# EAGLE design motor_driver (EAGLE 6.6.0)
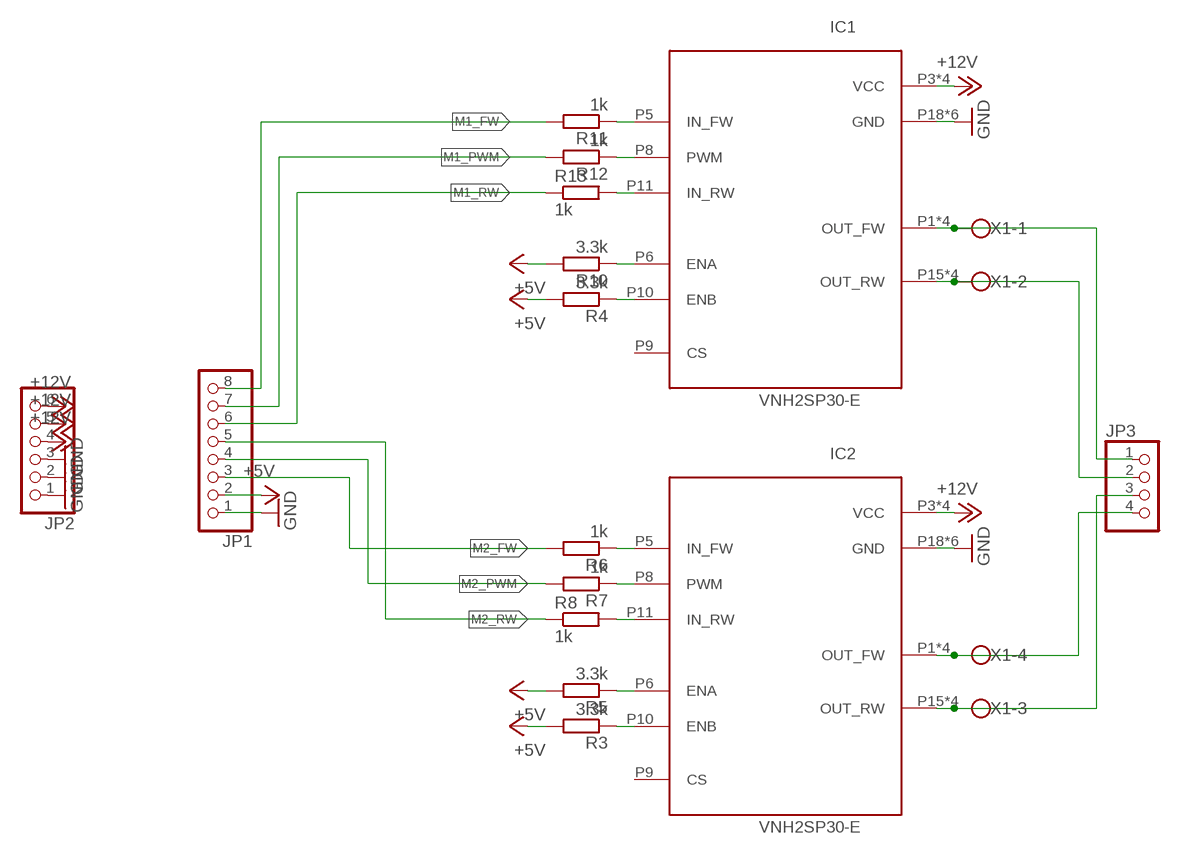
[diagram p0: schematic, sheet 1]

## Parts
IC1  VNH2SP30-E  [MP-SO-30]
IC2  VNH2SP30-E  [MP-SO-30]
JP1  PINHD-1X08_2.54-S  [1X08-S]
JP2  PINHD-1X06_2.54-S  [1X06-S]
JP3  PINHD-1X04_2.54-S  [1X04-S]
R3  3.3k  R-EU_R0805  [R0805]
R4  3.3k  R-EU_R0805  [R0805]
R5  3.3k  R-EU_R0805  [R0805]
R6  1k  R-EU_R0805  [R0805]
R7  1k  R-EU_R0805  [R0805]
R8  1k  R-EU_R0805  [R0805]
R10  3.3k  R-EU_R0805  [R0805]
R11  1k  R-EU_R0805  [R0805]
R12  1k  R-EU_R0805  [R0805]
R13  1k  R-EU_R0805  [R0805]
X1  KLEMME_4-PIN  [KLEMME_4-PIN]

## Nets
+5V [5v]: JP1.2 R3.2 R4.2 R5.2 R10.2
+12V: IC1.P3(VCC) IC1.P13(VCC) IC1.P23(VCC) IC1.S1(VCC) IC2.P3(VCC) IC2.P13(VCC) IC2.P23(VCC) IC2.S1(VCC) JP2.4 JP2.5 JP2.6
GND [5v]: IC1.P18(GND) IC1.P19(GND) IC1.P20(GND) IC1.P26(GND) IC1.P27(GND) IC1.P28(GND) IC2.P18(GND) IC2.P19(GND) IC2.P20(GND) IC2.P26(GND) IC2.P27(GND) IC2.P28(GND) JP1.1 JP2.1 JP2.2 JP2.3
M1_FW: JP1.8 R11.2
M1_PWM: JP1.7 R12.2
M1_RW: JP1.6 R13.1
M2_FW: JP1.3 R6.2
M2_PWM: JP1.4 R7.2
M2_RW: JP1.5 R8.1
N$1: IC2.P5(IN_FW) R6.1
N$2: IC2.P6(ENA) R5.1
N$3: IC1.P5(IN_FW) R11.1
N$4: IC2.P10(ENB) R3.1
N$6: IC2.P8(PWM) R7.1
N$7: IC1.P6(ENA) R10.1
N$8: IC1.P10(ENB) R4.1
N$10: IC1.P8(PWM) R12.1
N$11: IC1.P11(IN_RW) R13.2
N$12 [power]: IC1.P1(OUT_FW) IC1.P25(OUT_FW) IC1.P30(OUT_FW) IC1.S2(OUT_FW) JP3.1 X1.1
N$13 [power]: IC1.P15(OUT_RW) IC1.P16(OUT_RW) IC1.P21(OUT_RW) IC1.S3(OUT_RW) JP3.2 X1.2
N$14: IC2.P11(IN_RW) R8.2
N$17: IC2.P15(OUT_RW) IC2.P16(OUT_RW) IC2.P21(OUT_RW) IC2.S3(OUT_RW) JP3.3 X1.3
N$19: IC2.P1(OUT_FW) IC2.P25(OUT_FW) IC2.P30(OUT_FW) IC2.S2(OUT_FW) JP3.4 X1.4
Unconnected: IC1.P9(CS) IC2.P9(CS)

## Library data of the parts
IC1 IC2 = motor-driver:VNH2SP30-E: VNH2SP30-E full bridge motor driver 40V-30A
JP1 = pinhead-2:PINHD-1X08: PIN HEADER
JP2 = pinhead-2:PINHD-1X06: PIN HEADER
JP3 = pinhead-2:PINHD-1X04: PIN HEADER
R3-R8 R10-R13 = rcl:R-EU_: RESISTOR, European symbol
X1 = Schraubklemme:KLEMME_4-PIN

## Net classes
0 default: width 0.254 mm, drill 0.5 mm
1 5v: width 0.254 mm, drill 0.5 mm
2 power: width 0.406 mm, drill 0.5 mm, clearance 0.1 mm

## Board
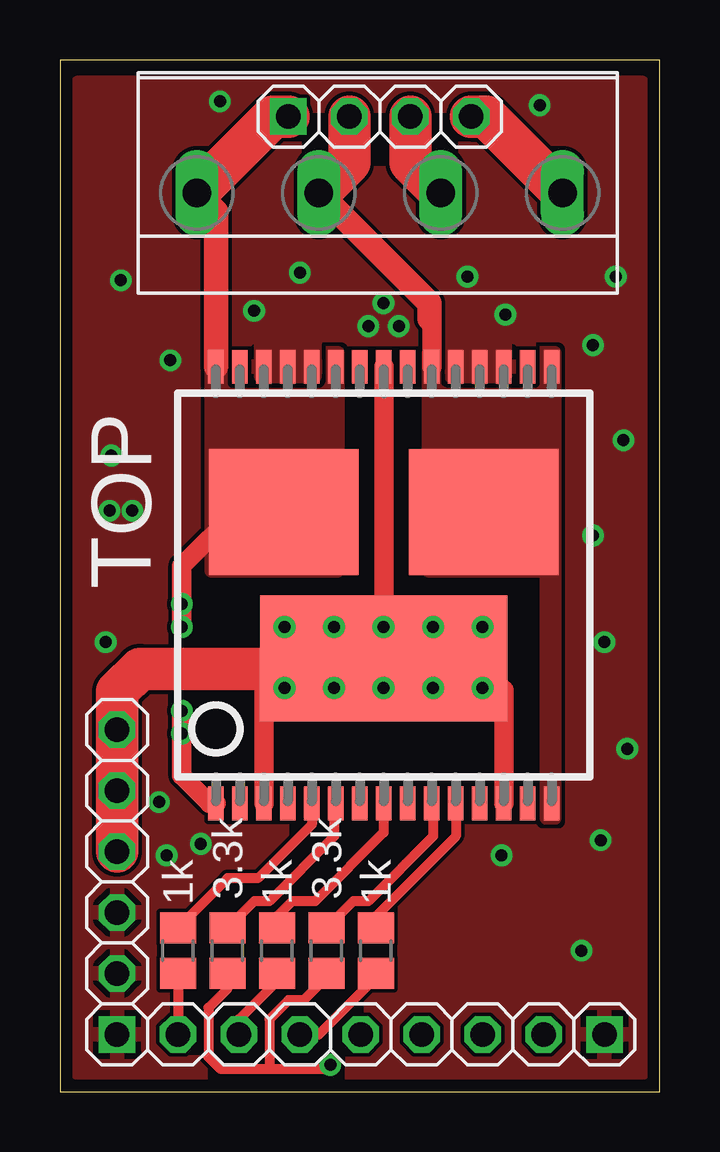
[diagram p1: board, top side]
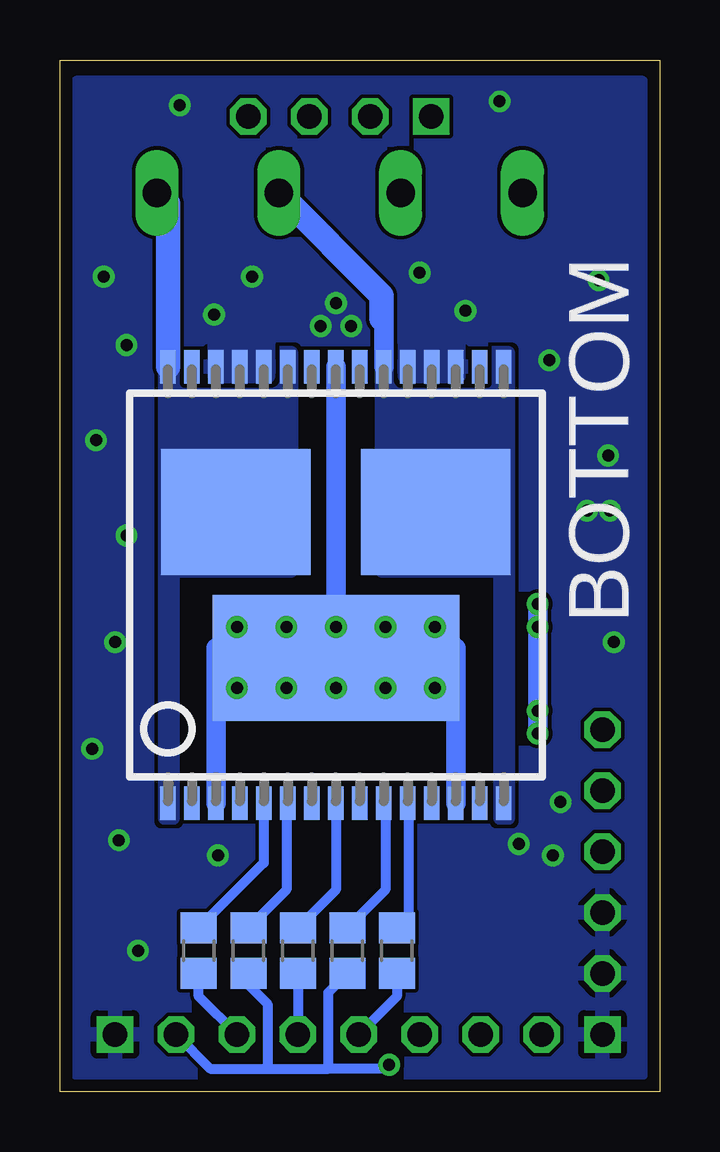
[diagram p2: board, bottom side, seen from below]

Size 25 x 43 mm. Coordinates in mm from the lower left corner, seen from the top.
Outline: 0,0 25,0 25,43 0,43 0,0
Copper layers (1*16): Top 0.035mm / dielectric 1.5mm / Bottom 0.035mm
Design rules "default *": minimum track width 10mil, minimum drill 18mil, track to track 6mil, track to pad 6mil, pad to pad 6mil, via to via 6mil, smd to smd 0mil, copper to edge 20mil, drill to drill 8mil, minimum pad ring 10mil, minimum via ring 8mil, stop-mask expansion 4mil, vias tented up to drill 20mil, thermal gap 10mil

### Footprints (pad centres in the part's own frame; a part is rotated, then mirrored left to right if it is on the bottom)
MP-SO-30 = smd 0.65 x 1.4: NC1 -6,9.1; NC2 -1,9.1; NC3 1,9.1; NC4 6,9.1; NC5 -6,-9.1; NC6 -4,-9.1; NC7 -1,-9.1; NC8 4,-9.1; NC9 6,-9.1; P1 -7,-9.1; P3 -5,-9.1; P5 -3,-9.1; P6 -2,-9.1; P8 0,-9.1; P9 1,-9.1; P10 2,-9.1; P11 3,-9.1; P13 5,-9.1; P15 7,-9.1; P16 7,9.1; P18 5,9.1; P19 4,9.1; P20 3,9.1; P21 2,9.1; P23 0,9.1; P25 -2,9.1; P26 -3,9.1; P27 -4,9.1; P28 -5,9.1; P30 -7,9.1 | smd 10.3 x 5.25: S1 0,-3.05 | smd 6.23 x 5.25: S2 -4.165,3.05; S3 4.165,3.05
1X08-S = drill 1.016 square: 1 -8.89,0 | drill 1.016 octagon: 2 -6.35,0; 3 -3.81,0; 4 -1.27,0; 5 1.27,0; 6 3.81,0; 7 6.35,0; 8 8.89,0
1X06-S = drill 1.016 square: 1 -6.35,0 | drill 1.016 octagon: 2 -3.81,0; 3 -1.27,0; 4 1.27,0; 5 3.81,0; 6 6.35,0
1X04-S = drill 1.016 square: 1 -3.81,0 | drill 1.016 octagon: 2 -1.27,0; 3 1.27,0; 4 3.81,0
R0805 = smd 1.3 x 1.5: 1 -0.95,0; 2 0.95,0
KLEMME_4-PIN = drill 1.194 long: 1 -2.54,0; 2 2.54,0; 3 7.62,0; 4 12.7,0

### Placement (x,y rotation side)
IC1  13.5,21.11 0 top
IC2  13.49,21.11 0 bottom
JP1  13.81,2.38 180 top
JP2  2.38,8.73 90 top
JP3  13.34,40.64 0 top
R3  13.02,5.87 270 bottom
R4  11.11,5.87 270 top
R5  17.14,5.87 270 bottom
R6  19.21,5.87 270 bottom
R7  15.08,5.87 270 bottom
R8  10.95,5.87 90 bottom
R10  6.99,5.87 270 top
R11  4.92,5.87 270 top
R12  9.05,5.87 270 top
R13  13.18,5.87 90 top
X1  8.26,37.47 0 top

### Tracks (layer width: path | path; a pad name or v marks a point on that pad's centre or on a via)
+5V  (via drill 0.5)
  Top 0.406: R10.2 6.99,4.29 6.19,3.49 6.19,1.43 6.67,0.95 8.73,0.95 | 8.73,0.95 11.11,0.95 v11.27,1.11 | R4.2 10.8,4.92 10.8,4.61 10.79,4.6 10.79,4.45 10.16,3.81 9.53,3.81 8.73,3.02 8.73,0.95
  Bottom 0.406: JP1.2 18.73,0.95 16.35,0.95 | 16.35,0.95 13.81,0.95 | 13.81,0.95 13.81,4.13 R3.2 | R5.2 17.14,4.45 16.35,3.65 16.35,0.95 | v11.27,1.11 11.43,0.95 13.81,0.95
+12V  (via drill 0.5)
  Top 0.406: IC1.S1 12.19,19.37 v11.43,19.37 | IC2.S1 IC1.S1 | IC1.S1 14.73,16.83 v15.56,16.83 15.4,17.3 15.88,17.78 16.67,18.57 v17.62,19.37 | 12.86,19.05 12.38,18.57 | v9.37,19.37 9.84,18.57 10.08,18.34 10.32,18.1 9.84,17.62 v9.37,16.83 | 13.5,19.21 13.49,19.21 v13.49,19.37 v13.5,19.36 13.5,19.05 | 12.86,19.05 12.38,19.05 | 12.38,19.05 11.43,18.1 | 12.38,19.05 12.06,19.05 v11.43,19.37 | IC1.S1 13.5,19.04 13.49,19.05 | 13.49,19.05 12.86,19.05 | v11.43,19.37 13.18,19.37 13.49,19.05
  Top 0.813: IC1.P3 8.5,18.01 8.57,18.1 10.32,18.1 11.43,18.1 11.59,18.1 | 11.59,18.1 13.46,18.1 IC1.S1 | IC1.P23 13.5,19.21 | 13.5,19.05 IC1.S1 | IC1.P13 18.5,16.74 17.54,17.7 | 17.54,17.7 16.67,18.57 | v11.43,16.83 11.59,18.1 | v13.49,16.83 IC2.S1 IC1.S1 | v15.56,19.37 15.56,18.1 15.88,17.78 | v17.62,16.83 17.46,17.62 17.54,17.7
  Top 1.778: JP2.4 JP2.5 | JP2.5 JP2.6 | JP2.5 2.38,16.67 3.33,17.62 9.37,17.62 10.08,18.34
  Bottom 0.406: IC2.S1 v13.49,19.37
  Bottom 0.813: IC2.P23 v13.49,19.37 13.49,19.05 | 10,19.05 8.49,17.54 IC2.P13 8.49,18.5 v9.37,19.37 | IC2.P3 18.49,18.5 v17.62,19.37
GND  (via drill 0.5)
  other vias: 4.13,12.06 5.87,10.32 4.45,9.84 18.41,9.84 21.75,5.87 22.54,10.48 23.65,14.29 22.7,18.73 22.23,23.18 23.5,27.15 22.23,31.11 23.18,33.97 18.57,32.38 16.99,33.97 8.1,32.54 10,34.13 2.54,33.81 4.6,30.48 2.14,26.51 2.06,24.21 1.91,18.73 12.86,31.91 14.13,31.91 13.49,32.86 6.67,41.27 20,41.12 3.02,24.21
  pour Bottom (rank 6): 0.77,42.05 24.27,42.05 24.27,0.77 0.77,0.77
  pour Top (no thermals): 16.33,29.82 18.55,29.82 18.55,33.95 16.33,33.95
  pour Top (no thermals): 8.39,29.82 10.61,29.82 10.61,33.47 8.39,33.47
  pour Top (rank 6): 0.77,42.05 24.27,42.05 24.27,0.77 0.77,0.77
  pour Bottom (no thermals): 8.39,29.82 10.61,29.82 10.61,33.79 8.39,33.79
  pour Bottom (no thermals): 16.33,29.82 18.55,29.82 18.55,33.47 16.33,33.47
M1_FW
  Top 0.406: R11.2 JP1.8
M1_PWM
  Top 0.406: R12.2 9.05,4.6 7.46,3.02 JP1.7
M1_RW
  Top 0.406: R13.1 13.18,4.76 10.79,2.38 JP1.6
M2_FW
  Bottom 0.406: JP1.3 19.21,3.97 R6.2
M2_PWM
  Bottom 0.406: R7.2 JP1.4
M2_RW
  Bottom 0.406: R8.1 10.95,3.97 JP1.5
N$1
  Bottom 0.406: IC2.P5 16.51,12 16.51,9.53 R6.1
N$2
  Bottom 0.406: IC2.P6 15.56,11.95 15.56,8.41 R5.1
N$3
  Top 0.406: IC1.P5 10.5,11.13 8.26,8.89 6.99,8.89 R11.1
N$4
  Bottom 0.406: IC2.P10 11.43,11.95 11.43,8.41 R3.1
N$6
  Bottom 0.406: IC2.P8 13.49,8.41 R7.1
N$7
  Top 0.406: IC1.P6 11.43,11.94 11.43,10.64 8.73,7.94 8.1,7.94 R10.1
N$8
  Top 0.406: IC1.P10 15.56,11.95 15.56,10.64 12.86,7.94 12.22,7.94 R4.1
N$10
  Top 0.406: IC1.P8 13.49,10.79 10.64,7.94 9.68,7.94 9.05,7.3 R12.1
N$11
  Top 0.406: IC1.P11 16.51,10.64 13.18,7.3 R13.2
N$12  (via drill 0.5)
  Top 0.813: IC1.P1 6.25,12.01 5.08,13.18 v5.08,15.88 | v5.08,19.37 v5.08,20.32 5.08,21.91 7.46,24.29 9.21,24.29 IC1.S2
  Top 1.016: IC1.P30 6.5,36.68 X1.1
  Top 1.778: JP3.1 8.89,40.64 X1.1
  Bottom 0.813: v5.08,14.92 v5.08,15.88 v5.08,20.32
  pour Top (isolate 0.178, rank 3, no thermals): 11.56,30.77 11.56,21.73 6.33,21.73 6.33,30.77
N$13
  Top 0.813: IC1.P21 15.5,32.12 15.4,32.23
  Top 1.016: 15.4,32.23 15.4,32.86 X1.2
  Top 1.778: JP3.2 12.06,38.73 X1.2
  pour Top (isolate 0.178, rank 3, no thermals): 15.38,30.77 15.38,21.73 20.3,21.73 20.3,11.41 20.61,11.41 20.61,30.77
N$14
  Bottom 0.406: IC2.P11 10.48,12 10.48,7.3 R8.2
N$17
  Top 1.778: JP3.3 14.61,38.73 X1.3
  Bottom 0.813: IC2.P21 11.49,32.13 11.59,32.23
  Bottom 1.016: 11.59,32.23 11.59,33.18 X1.3
  pour Bottom (isolate 0.178, rank 3, no thermals): 11.56,30.77 11.56,21.73 6.64,21.73 6.64,11.41 6.33,11.41 6.33,30.77
N$19
  Top 1.778: JP3.4 17.78,40.64 X1.4
  Bottom 1.016: IC2.P30 20.49,37 X1.4
  pour Bottom (isolate 0.178, rank 3, no thermals): 15.38,30.77 15.38,21.73 20.3,21.73 20.3,11.41 20.61,11.41 20.61,30.77

### Text on the board
tPlace: TOP
bPlace: BOTTOM